# EAGLE design A4a Wireless Stick Lite (EAGLE 9.6.2)
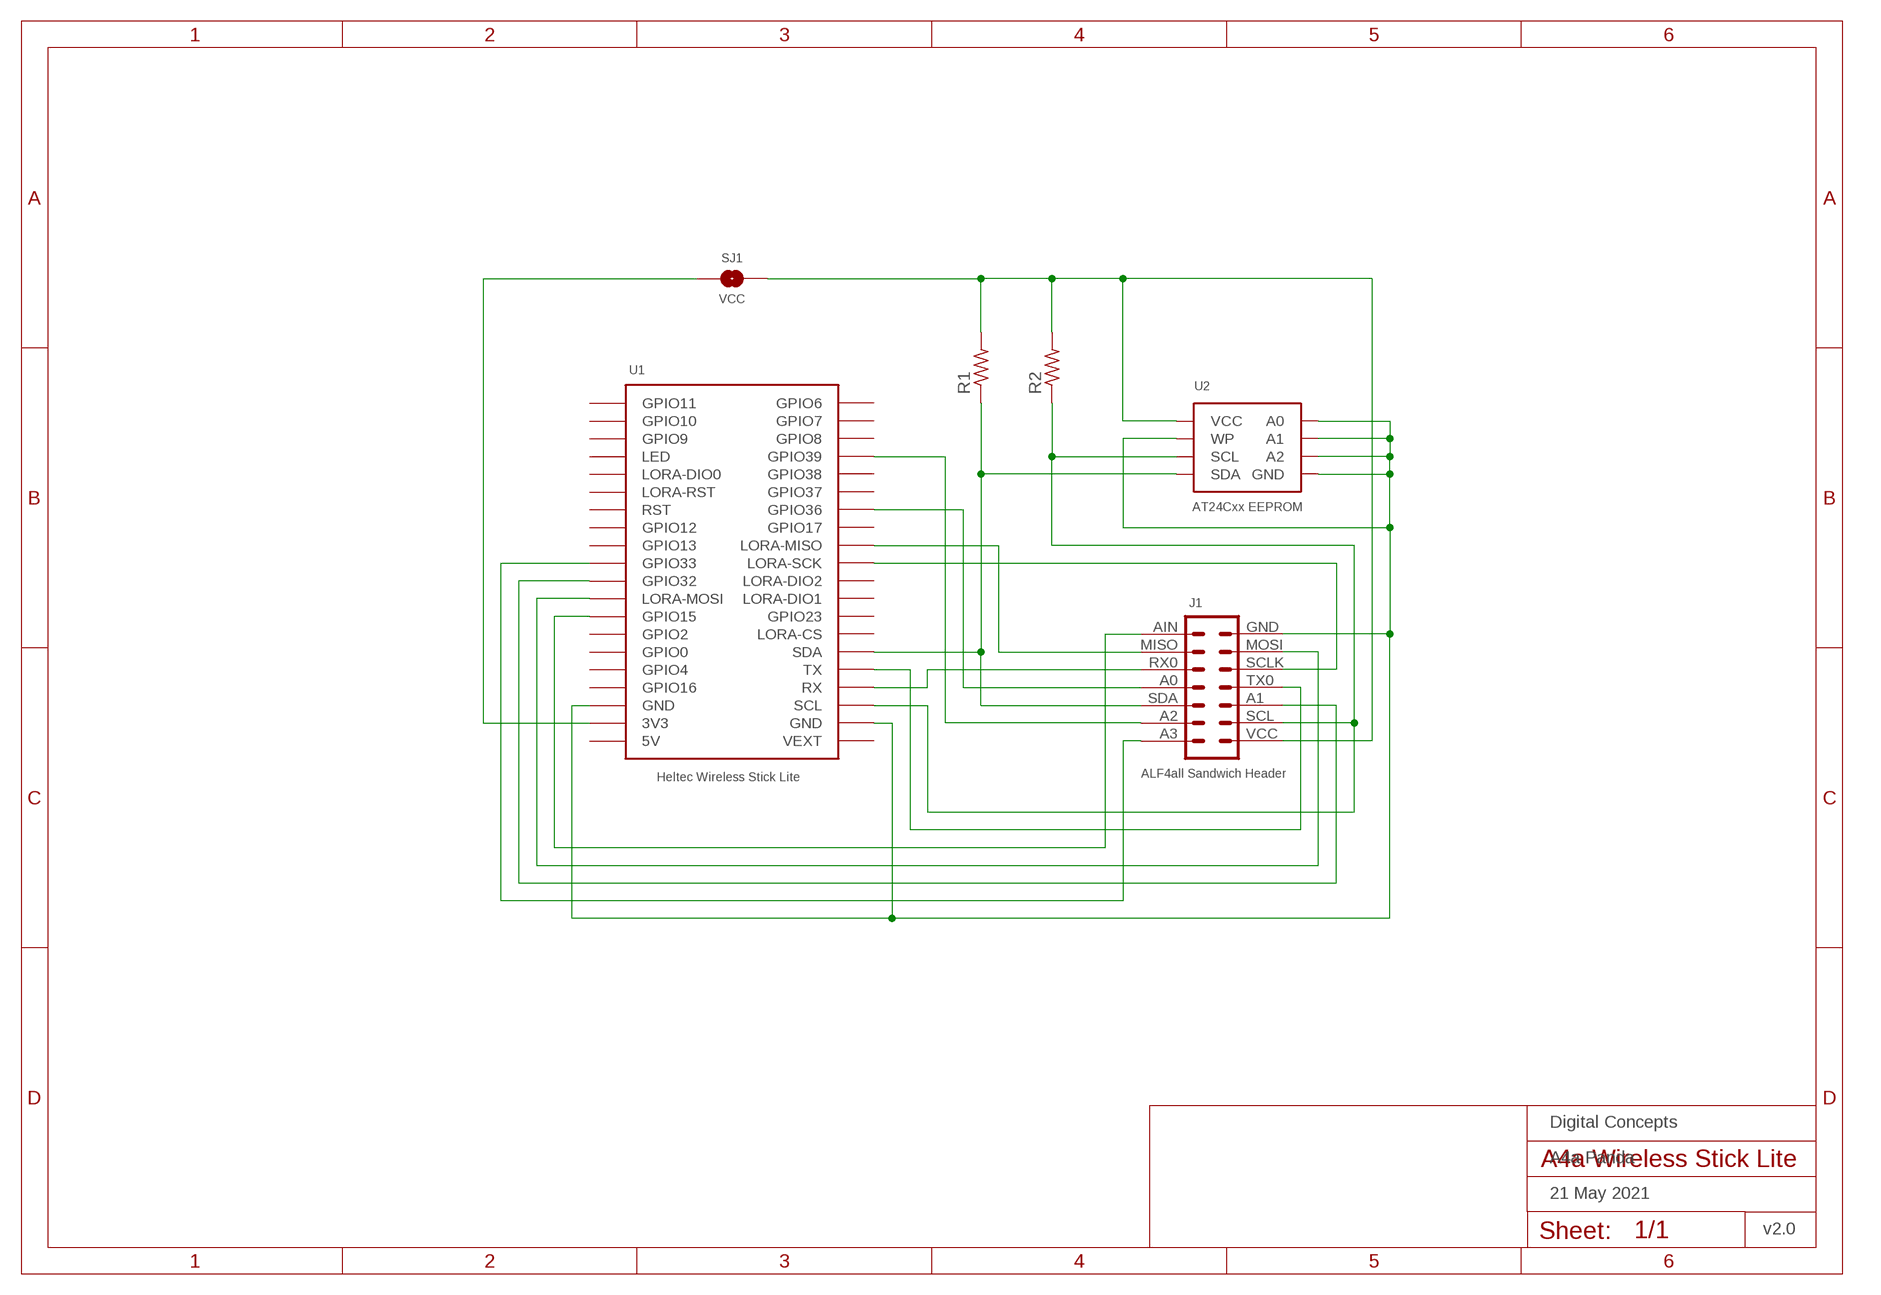
[diagram p0: schematic, sheet 1]
FRAME1 (A4L-LOC): DATE: 21 May 2021; OWNER: Digital Concepts; TITLE: A4a Panda; VERSION: v2.0

## Parts
J1  ALF4all Sandwich Header  HEADER-2X7-ALF4ALL-PROCESSOR-B  [CONN_2X7-ALF4ALL-PROCESSOR-B]
R1  RESISTOR-VIA-1  [R0805-VIA-1]
R2  RESISTOR-VIA-1  [R0805-VIA-1]
SJ1  VCC  SJ  [SJ]
U1  Heltec Wireless Stick Lite  HELTEC-WIRELESS-STICK-LITE  [HELTEC-WIRELESS-STICK-LITE]
U2  AT24Cxx EEPROM  AT24CXX-EEPROM-VIA-7  [SOP-8-WITH-VIA-7]

## Nets
GND: J1.GND U1.GND@18(GND) U1.GND@22(GND) U2.P$1(A0) U2.P$2(A1) U2.P$3(A2) U2.P$4(GND) U2.P$7(WP) U2.P$7@VIA(WP)
N$1: J1.SCL R2.1 R2.1@VIA U1.SCL U2.P$6(SCL)
N$2: J1.MISO U1.LORA-MISO
N$3: J1.SCLK U1.LORA-SCK
N$4: J1.SDA R1.1 R1.1@VIA U1.SDA U2.P$5(SDA)
N$5: J1.RX0 U1.RX
N$6: J1.TX0 U1.TX
N$7: J1.A0 U1.GPIO36
N$8: J1.A2 U1.GPIO39
N$9: J1.A3 U1.GPIO33
N$10: J1.MOSI U1.LORA-MOSI
N$11: J1.A1 U1.GPIO32
N$12: J1.AIN U1.GPIO15
N$13: SJ1.1 U1.3V3
VCC: J1.VCC R1.2 R2.2 SJ1.2 U2.P$8(VCC)
Unconnected: U1.5V U1.GPIO0 U1.GPIO2 U1.GPIO4 U1.GPIO6 U1.GPIO7 U1.GPIO8 U1.GPIO9 U1.GPIO10 U1.GPIO11 U1.GPIO12 U1.GPIO13 U1.GPIO16 U1.GPIO17 U1.GPIO23 U1.GPIO37 U1.GPIO38 U1.LED U1.LORA-CS U1.LORA-DIO0 U1.LORA-DIO1 U1.LORA-DIO2 U1.LORA-RST U1.RST U1.VEXT

## Library data of the parts
J1 = digitalconcepts:HEADER-2X7-ALF4ALL-PROCESSOR-B: ALF4all 'Sandwich' Processor (Bottom) 2x7 Pin Header Header soldered to underside of PCB
R1 R2 = digitalconcepts:RESISTOR-VIA-1: Resistor with via on Pad 1
SJ1 = digitalconcepts:SJ: Solder Jumper
U1 = digitalconcepts:HELTEC-WIRELESS-STICK-LITE: Heltec Wireless Stick Lite MCU
U2 = digitalconcepts:AT24CXX-EEPROM-VIA-7: AT24Cxx EEPROM SOP-8

## Board
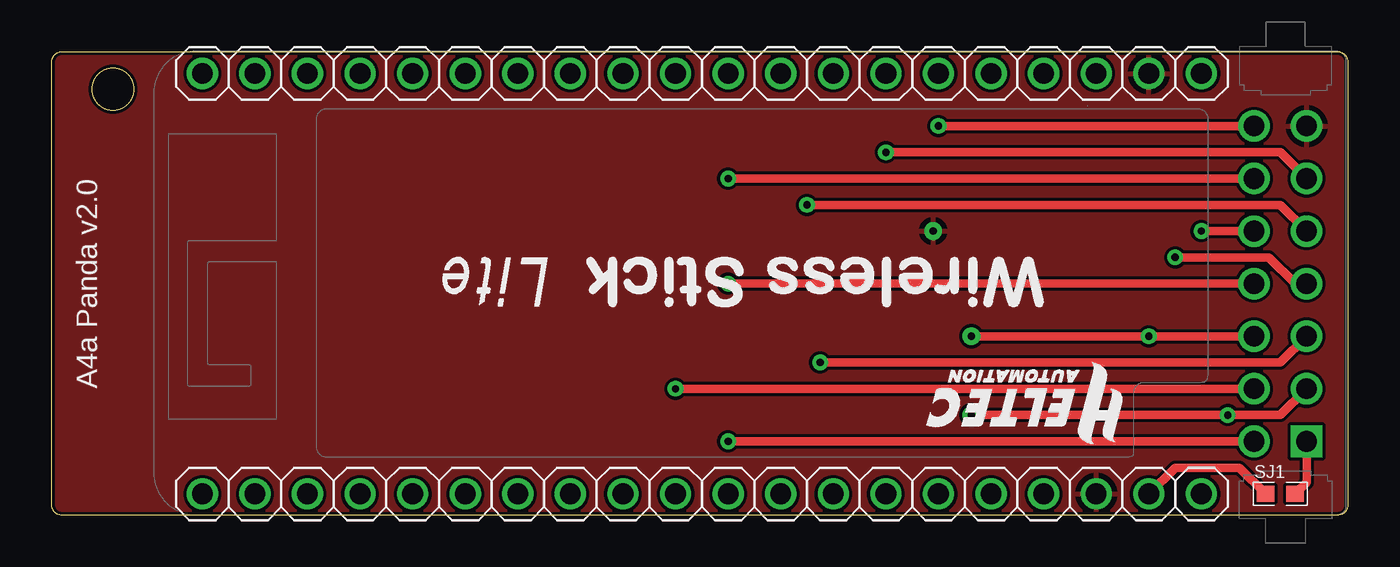
[diagram p1: board, top side]
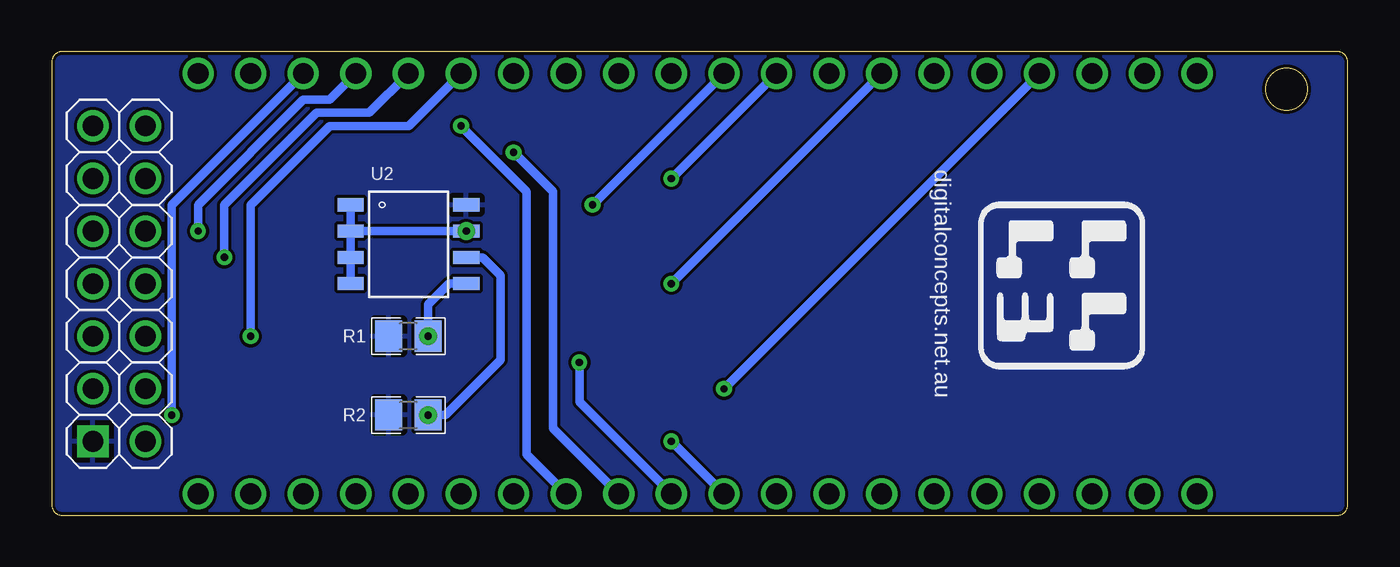
[diagram p2: board, bottom side, seen from below]

Size 62.6 x 22.4 mm. Coordinates in mm from the lower left corner, seen from the top.
Outline: 62.14,22.4 62.18,22.4 62.21,22.39 62.24,22.38 62.27,22.37 62.3,22.36 62.33,22.35 62.36,22.33 62.38,22.31 62.41,22.3 62.43,22.28 62.48,22.23 62.5,22.21 62.52,22.18 62.53,22.15 62.55,22.12 62.56,22.09 62.57,22.06 62.58,22.03 62.59,22 62.6,21.97 62.6,21.93 62.6,0.47 62.6,0.43 62.59,0.4 62.58,0.37 62.57,0.34 62.56,0.31 62.55,0.28 62.53,0.25 62.52,0.22 62.5,0.19 62.48,0.17 62.43,0.12 62.41,0.1 62.38,0.09 62.36,0.07 62.33,0.05 62.3,0.04 62.27,0.03 62.24,0.02 62.21,0.01 62.18,0 62.14,0 0.46,0 0.42,0 0.39,0.01 0.36,0.02 0.33,0.03 0.3,0.04 0.27,0.05 0.24,0.07 0.22,0.09 0.19,0.1 0.17,0.12 0.14,0.15 0.12,0.17 0.1,0.19 0.08,0.22 0.07,0.25 0.05,0.28 0.04,0.31 0.03,0.34 0.02,0.37 0.01,0.4 0,0.43 0,0.47 0,21.93 0,21.97 0.01,22 0.02,22.03 0.03,22.06 0.04,22.09 0.05,22.12 0.07,22.15 0.08,22.18 0.1,22.21 0.12,22.23 0.14,22.25 0.17,22.28 0.19,22.3 0.22,22.31 0.24,22.33 0.27,22.35 0.3,22.36 0.33,22.37 0.36,22.38 0.39,22.39 0.42,22.4 0.46,22.4 62.14,22.4
Outline: circle at 2.95,20.59 radius 1.02
Copper layers (1*16): Top 0.035mm / dielectric 1.5mm / Bottom 0.035mm
Design rules "default *": minimum track width 6mil, minimum drill 0.35mm, track to track 6mil, track to pad 6mil, pad to pad 6mil, via to via 6mil, smd to smd 6mil, copper to edge 6mil, drill to drill 6mil, minimum pad ring 10mil, minimum via ring 8mil, stop-mask expansion 4mil, vias tented up to drill 0mil, thermal gap 10mil

### Footprints (pad centres in the part's own frame; a part is rotated, then mirrored left to right if it is on the bottom)
CONN_2X7-ALF4ALL-PROCESSOR-B = drill 1 pad 1.524: A0 7.62,2.54; A1 5.08,0; A2 2.54,2.54; A3 0,2.54; AIN 15.24,2.54; GND 15.24,0; MISO 12.7,2.54; MOSI 12.7,0; RX0 10.16,2.54; SCL 2.54,0; SCLK 10.16,0; SDA 5.08,2.54; TX0 7.62,0 | drill 1 pad 1.524 square: VCC 0,0
R0805-VIA-1 = smd 1.3 x 1.5: 1 -0.95,0; 2 0.95,0 | drill 0.35 pad 0.61: 1@VIA -0.95,0
SJ = smd 0.864 x 0.762: 1 -0.711,0; 2 0.711,0
HELTEC-WIRELESS-STICK-LITE = drill 1: 3V3 0,45.72; 5V 0,48.26; GND@18 0,43.18; GND@22 -20.32,45.72; GPIO0 0,35.56; GPIO2 0,33.02; GPIO4 0,38.1; GPIO6 -20.32,0; GPIO7 -20.32,2.54; GPIO8 -20.32,5.08; GPIO9 0,5.08; GPIO10 0,2.54; GPIO11 0,0; GPIO12 0,17.78; GPIO13 0,20.32; GPIO15 0,30.48; GPIO16 0,40.64; GPIO17 -20.32,17.78; GPIO23 -20.32,30.48; GPIO32 0,25.4; GPIO33 0,22.86; GPIO36 -20.32,15.24; GPIO37 -20.32,12.7; GPIO38 -20.32,10.16; GPIO39 -20.32,7.62; LED 0,7.62; LORA-CS -20.32,33.02; LORA-DIO0 0,10.16; LORA-DIO1 -20.32,27.94; LORA-DIO2 -20.32,25.4; LORA-MISO -20.32,20.32; LORA-MOSI 0,27.94; LORA-RST 0,12.7; LORA-SCK -20.32,22.86; RST 0,15.24; RX -20.32,40.64; SCL -20.32,43.18; SDA -20.32,35.56; TX -20.32,38.1; VEXT -20.32,48.26
SOP-8-WITH-VIA-7 = smd 0.635 x 1.27: P$1 -1.905,-2.794; P$2 -0.635,-2.794; P$3 0.635,-2.794; P$4 1.905,-2.794; P$5 1.905,2.794; P$6 0.635,2.794; P$7 -0.635,2.794; P$8 -1.905,2.794 | drill 0.35 pad 0.61: P$7@VIA -0.635,2.794

### Placement (x,y rotation side)
J1  60.61,3.57 90 top
R1  45.37,8.65 180 bottom
R2  45.37,4.84 180 bottom
SJ1  59.34,1.03 0 top
U1  7.27,1.03 270 top
U2  45.37,13.09 270 bottom

### Tracks (layer width: path | path; a pad name or v marks a point on that pad's centre or on a via)
GND
  Bottom 0.406: U2.P$2 U2.P$1 | U2.P$2 U2.P$7@VIA | U2.P$2 U2.P$3 U2.P$4
  pour Top (rank 3): -1.62,23.89 63.79,23.89 63.79,-1.51 -1.62,-1.51
N$1  (via drill 0.35)
  Top 0.406: J1.SCL 59.34,4.84 v56.8,4.84 R2.1@VIA
  Bottom 0.406: U1.SCL 56.8,15 v56.8,4.84 | R2.1@VIA 43.58,4.84 40.93,7.5 40.93,11.6 41.79,12.46 U2.P$6
N$2  (via drill 0.35)
  Top 0.406: v32.67,16.27 J1.MISO
  Bottom 0.406: U1.LORA-MISO v32.67,16.27
N$3  (via drill 0.35)
  Top 0.406: J1.SCLK 59.34,15 v36.48,15
  Bottom 0.406: v36.48,15 U1.LORA-SCK
N$4  (via drill 0.35)
  Top 0.406: J1.SDA v52.99,8.65 R1.1@VIA
  Bottom 0.406: U1.SDA 45.37,18.81 49.18,18.81 52.99,15 v52.99,8.65 | R1.1@VIA 44.42,10.17 43.41,11.19 U2.P$5
N$5  (via drill 0.35)
  Top 0.406: J1.RX0 v55.53,13.73
  Bottom 0.406: v55.53,13.73 55.53,15 50.45,20.08 49.18,20.08 U1.RX
N$6  (via drill 0.35)
  Top 0.406: J1.TX0 60.06,11.19 58.79,12.46 v54.26,12.46
  Bottom 0.406: v54.26,12.46 54.26,15 49.82,19.44 47.28,19.44 U1.TX
N$7  (via drill 0.35)
  Top 0.406: J1.A0 v32.67,11.19
  Bottom 0.406: U1.GPIO36 v32.67,11.19
N$8  (via drill 0.35)
  Top 0.406: J1.A2 v30.13,6.11
  Bottom 0.406: U1.GPIO39 v30.13,6.11
N$9  (via drill 0.35)
  Top 0.406: J1.A3 v32.67,3.57
  Bottom 0.406: v32.67,3.57 U1.GPIO33
N$10  (via drill 0.35)
  Top 0.406: J1.MOSI 59.34,17.54 v40.29,17.54
  Bottom 0.406: v40.29,17.54 38.39,15.63 38.39,4.2 U1.LORA-MOSI
N$11  (via drill 0.35)
  Top 0.406: J1.A1 59.34,7.38 v37.12,7.38
  Bottom 0.406: v37.12,7.38 37.12,5.47 U1.GPIO32
N$12  (via drill 0.35)
  Top 0.406: J1.AIN v42.83,18.81
  Bottom 0.406: v42.83,18.81 39.66,15.63 39.66,2.93 U1.GPIO15
N$13
  Top 0.406: SJ1.1 57.36,2.3 54.26,2.3 U1.3V3
VCC
  Top 0.406: J1.VCC 60.61,1.59 SJ1.2
  pour Bottom (rank 3): -0.98,23.25 63.15,23.25 63.15,-0.88 -0.98,-0.88

### Text on the board
tPlace: A4a Panda v2.0
bPlace: digitalconcepts.net.au